# EAGLE design foo1 (EAGLE 6.6.0)
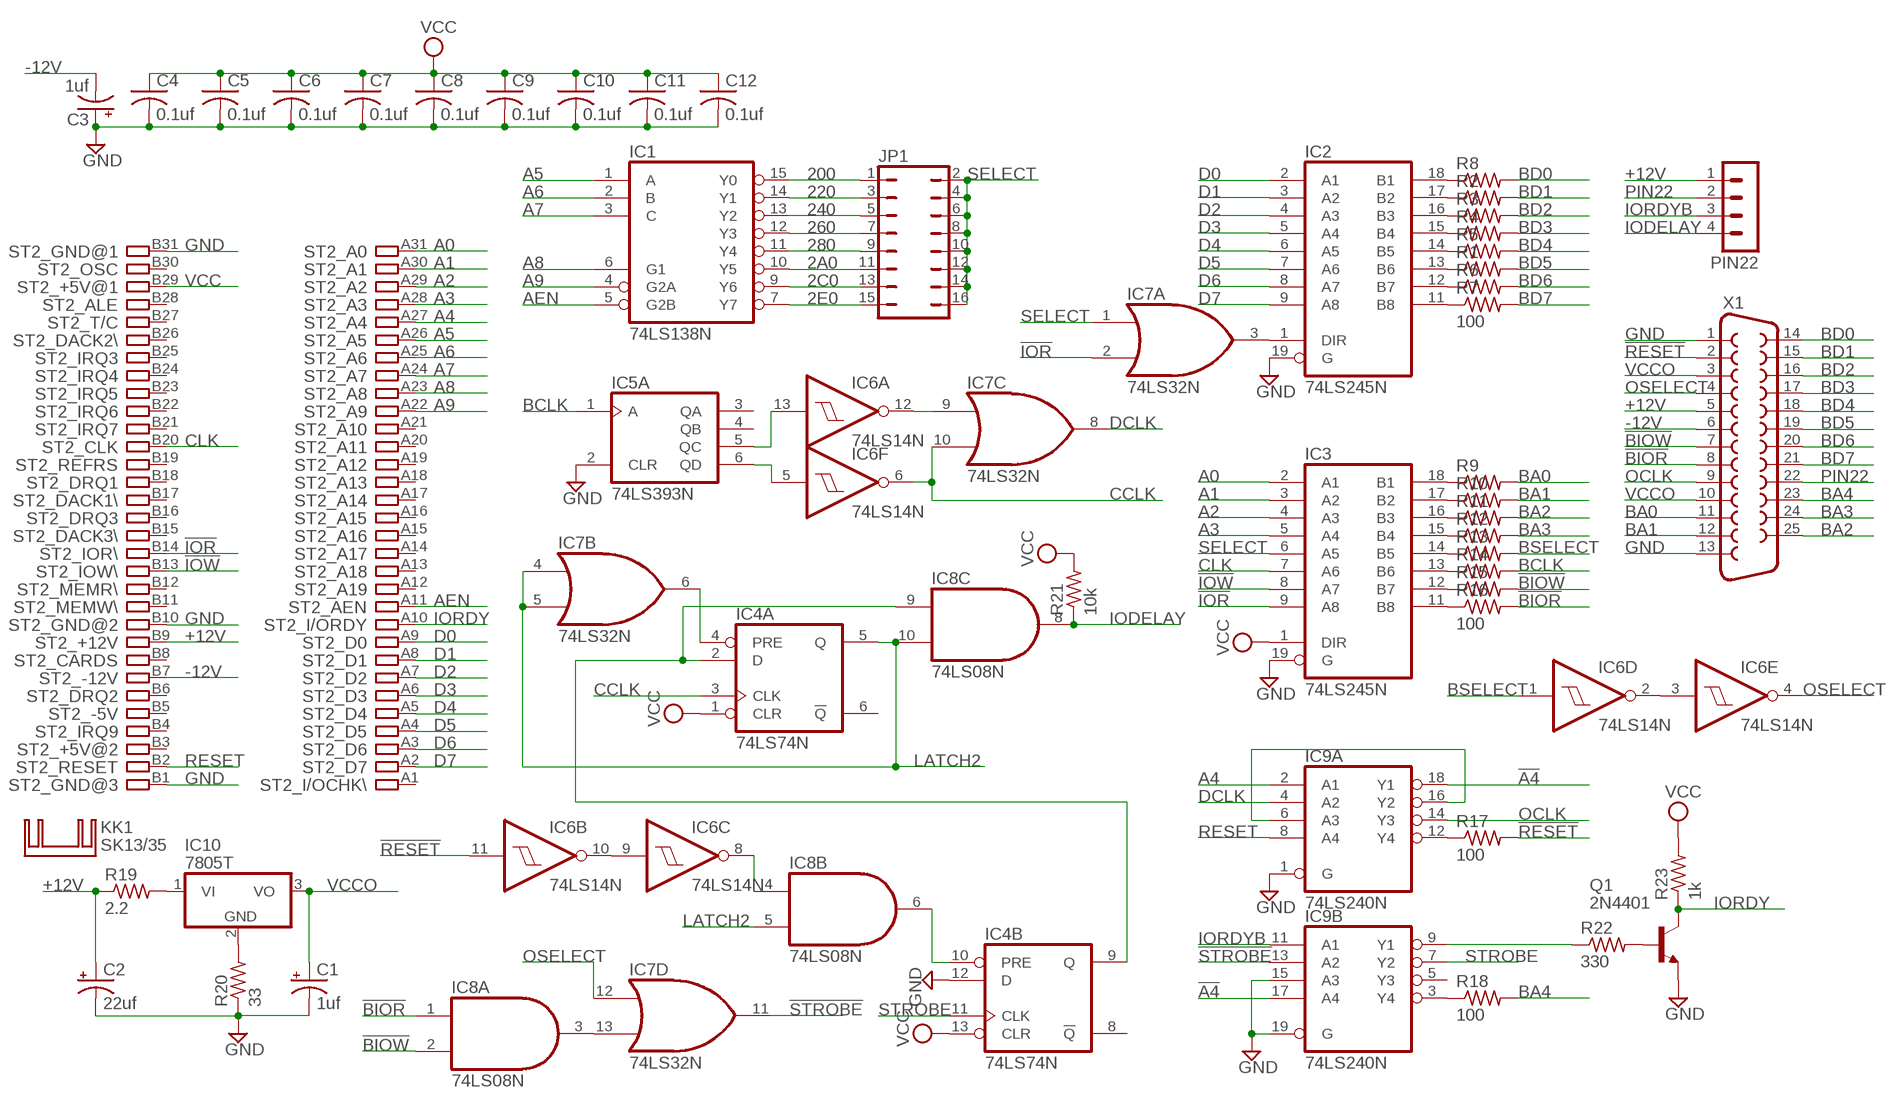
[diagram p0: schematic, sheet 1]

## Parts
C1  1uf  CPOL-USE5-10.5  [E5-10,5]
C2  22uf  CPOL-USE5-10.5  [E5-10,5]
C3  1uf  CPOL-USE5-10.5  [E5-10,5]
C4  0.1uf  C-US050-025X075  [C050-025X075]
C5  0.1uf  C-US050-025X075  [C050-025X075]
C6  0.1uf  C-US050-025X075  [C050-025X075]
C7  0.1uf  C-US050-025X075  [C050-025X075]
C8  0.1uf  C-US050-025X075  [C050-025X075]
C9  0.1uf  C-US050-025X075  [C050-025X075]
C10  0.1uf  C-US050-025X075  [C050-025X075]
C11  0.1uf  C-US050-025X075  [C050-025X075]
C12  0.1uf  C-US050-025X075  [C050-025X075]
IC1  74LS138N  [DIL16]
IC2  74LS245N  [DIL20]
IC3  74LS245N  [DIL20]
IC4  74LS74N  [DIL14]
IC5  74LS393N  [DIL14]
IC6  74LS14N  [DIL14]
IC7  74LS32N  [DIL14]
IC8  74LS08N  [DIL14]
IC9  74LS240N  [DIL20]
IC10  7805T  [TO220H]
JP1  JP8Q  [JP8Q]
KK1  SK13/35  [SK13/35]
PIN22  MA04-1  [MA04-1]
Q1  2N4401  2N4416  [TO92]
R1  R-US_0207/10  [0207/10]
R2  R-US_0207/10  [0207/10]
R3  R-US_0207/10  [0207/10]
R4  R-US_0207/10  [0207/10]
R5  R-US_0207/10  [0207/10]
R6  R-US_0207/10  [0207/10]
R7  100  R-US_0207/10  [0207/10]
R8  R-US_0207/10  [0207/10]
R9  R-US_0207/10  [0207/10]
R10  R-US_0207/10  [0207/10]
R11  R-US_0207/10  [0207/10]
R12  R-US_0207/10  [0207/10]
R13  R-US_0207/10  [0207/10]
R14  R-US_0207/10  [0207/10]
R15  R-US_0207/10  [0207/10]
R16  100  R-US_0207/10  [0207/10]
R17  100  R-US_0207/10  [0207/10]
R18  100  R-US_0207/10  [0207/10]
R19  2.2  R-US_0613/15  [P0613/15]
R20  33  R-US_0207/10  [0207/10]
R21  10k  R-US_0207/10  [0207/10]
R22  330  R-US_0207/10  [0207/10]
R23  1k  R-US_0207/10  [0207/10]
ST2  IBM8BIT  [IBM8BIT]
X1  F25H  [F25H]

## Nets
2A0: IC1.10(Y5) JP1.11
2C0: IC1.9(Y6) JP1.13
2E0: IC1.7(Y7) JP1.15
200: IC1.15(Y0) JP1.1
220: IC1.14(Y1) JP1.3
240: IC1.13(Y2) JP1.5
260: IC1.12(Y3) JP1.7
280: IC1.11(Y4) JP1.9
!A4: IC9.17(B:A4) IC9.18(A:Y1)
!BIOR: IC8.1(A:I0) R16.2 X1.8
!BIOW: IC8.2(A:I1) R15.2 X1.7
!IOR: IC3.9(A8) IC7.2(A:I1) ST2.B14
!IOW: IC3.8(A7) ST2.B13
!RESET: IC6.11(B:I) R17.2 X1.2
!STROBE: IC7.11(D:O) IC9.13(B:A2)
+12V [Power]: C2.+ PIN22.1 R19.1 ST2.B9 X1.5
-12V [Power]: C3.- ST2.B7 X1.6
A0: IC3.2(A1) ST2.A31
A1: IC3.3(A2) ST2.A30
A2: IC3.4(A3) ST2.A29
A3: IC3.5(A4) ST2.A28
A4: IC9.2(A:A1) ST2.A27
A5: IC1.1(A) ST2.A26
A6: IC1.2(B) ST2.A25
A7: IC1.3(C) ST2.A24
A8: IC1.6(G1) ST2.A23
A9: IC1.4(G2A) ST2.A22
AEN: IC1.5(G2B) ST2.A11
BA0: R9.2 X1.11
BA1: R10.2 X1.12
BA2: R11.2 X1.25
BA3: R12.2 X1.24
BA4: R18.2 X1.23
BCLK: IC5.1(A:A) R14.2
BD0: R8.2 X1.14
BD1: R2.2 X1.15
BD2: R3.2 X1.16
BD3: R4.2 X1.17
BD4: R5.2 X1.18
BD5: R1.2 X1.19
BD6: R6.2 X1.20
BD7: R7.2 X1.21
BSELECT: IC6.1(D:I) R13.2
CCLK: IC4.3(A:CLK) IC6.6(F:O) IC7.10(C:I1)
CLK: IC3.7(A6) ST2.B20
D0: IC2.2(A1) ST2.A9
D1: IC2.3(A2) ST2.A8
D2: IC2.4(A3) ST2.A7
D3: IC2.5(A4) ST2.A6
D4: IC2.6(A5) ST2.A5
D5: IC2.7(A6) ST2.A4
D6: IC2.8(A7) ST2.A3
D7: IC2.9(A8) ST2.A2
DCLK: IC7.8(C:O) IC9.4(A:A2)
GND [Power]: C1.- C2.- C3.+ C4.2 C5.2 C6.2 C7.2 C8.2 C9.2 C10.2 C11.2 C12.2 IC2.19(G) IC3.19(G) IC4.12(B:D) IC5.2(A:CLR) IC9.1(A:G) IC9.15(B:A3) IC9.19(B:G) Q1.3(E) R20.1 ST2.B1 ST2.B10 ST2.B31 X1.1 X1.13
IODELAY: IC8.8(C:O) PIN22.4 R21.1
IORDY: Q1.1(C) R23.1 ST2.A10
IORDYB: IC9.11(B:A1) PIN22.3
LATCH2: IC4.5(A:Q) IC7.4(B:I0) IC7.5(B:I1) IC8.5(B:I1) IC8.10(C:I1)
N$1: IC2.1(DIR) IC7.3(A:O)
N$2 [Power]: IC10.2(GND) R20.2
N$3: IC2.13(B6) R1.1
N$4: IC2.17(B2) R2.1
N$5: IC2.16(B3) R3.1
N$6: IC2.15(B4) R4.1
N$7: IC2.14(B5) R5.1
N$8: IC2.12(B7) R6.1
N$9: IC2.11(B8) R7.1
N$10: IC2.18(B1) R8.1
N$11: IC3.18(B1) R9.1
N$12: IC3.17(B2) R10.1
N$13: IC3.16(B3) R11.1
N$14: IC3.15(B4) R12.1
N$15: IC3.14(B5) R13.1
N$16: IC3.13(B6) R14.1
N$17: IC3.12(B7) R15.1
N$18: IC3.11(B8) R16.1
N$19: IC9.12(A:Y4) R17.1
N$20: IC6.9(C:I) IC6.10(B:O)
N$21: IC6.2(D:O) IC6.3(E:I)
N$22: IC5.6(A:QD) IC6.5(F:I)
N$23: IC9.3(B:Y4) R18.1
N$24: IC5.5(A:QC) IC6.13(A:I)
N$25 [Power]: IC10.1(VI) R19.2
N$26: IC6.12(A:O) IC7.9(C:I0)
N$28: IC9.6(A:A3) IC9.16(A:Y2)
N$29: IC7.13(D:I1) IC8.3(A:O)
N$30: IC4.2(A:D) IC4.9(B:Q) IC8.9(C:I0)
N$32: IC9.9(B:Y1) R22.1
N$33: IC4.10(B:PRE) IC8.6(B:O)
N$34: IC6.8(C:O) IC8.4(B:I0)
N$36: IC4.4(A:PRE) IC7.6(B:O)
N$37: Q1.2(B) R22.2
OCLK: IC9.14(A:Y3) X1.9
OSELECT: IC6.4(E:O) IC7.12(D:I0) X1.4
PIN22: PIN22.2 X1.22
RESET: IC9.8(A:A4) ST2.B2
SELECT: IC3.6(A5) IC7.1(A:I0) JP1.2 JP1.4 JP1.6 JP1.8 JP1.10 JP1.12 JP1.14 JP1.16
STROBE: IC4.11(B:CLK) IC9.7(B:Y2)
VCC [Power]: C4.1 C5.1 C6.1 C7.1 C8.1 C9.1 C10.1 C11.1 C12.1 IC3.1(DIR) IC4.1(A:CLR) IC4.13(B:CLR) R21.2 R23.2 ST2.B29
VCCO [Power]: C1.+ IC10.3(VO) X1.3 X1.10
Unconnected: IC4.6(A:!Q) IC4.8(B:!Q) IC5.3(A:QA) IC5.4(A:QB) IC5.8(B:QD) IC5.9(B:QC) IC5.10(B:QB) IC5.11(B:QA) IC5.12(B:CLR) IC5.13(B:A) IC8.11(D:O) IC8.12(D:I0) IC8.13(D:I1) IC9.5(B:Y3) ST2.A1 ST2.A12 ST2.A13 ST2.A14 ST2.A15 ST2.A16 ST2.A17 ST2.A18 ST2.A19 ST2.A20 ST2.A21 ST2.B3 ST2.B4 ST2.B5 ST2.B6 ST2.B8 ST2.B11 ST2.B12 ST2.B15 ST2.B16 ST2.B17 ST2.B18 ST2.B19 ST2.B21 ST2.B22 ST2.B23 ST2.B24 ST2.B25 ST2.B26 ST2.B27 ST2.B28 ST2.B30

## Power pins joined to a net without a drawn wire
GND: IC1.8(GND) IC2.10(GND) IC3.10(GND) IC4.7(P:GND) IC5.7(P:GND) IC6.7(P:GND) IC7.7(P:GND) IC8.7(P:GND) IC9.10(P:GND)
VCC: IC1.16(VCC) IC2.20(VCC) IC3.20(VCC) IC4.14(P:VCC) IC5.14(P:VCC) IC6.14(P:VCC) IC7.14(P:VCC) IC8.14(P:VCC) IC9.20(P:VCC)

## Library data of the parts
C1-C3 = rcl:CPOL-US: POLARIZED CAPACITOR, American symbol
C4-C12 = rcl:C-US: CAPACITOR, American symbol
IC1 = 74xx-us:74*138: 3-line to 8-line DECODER/DEMULTIPLEXER
IC2 IC3 = 74xx-us:74*245: Octal BUS TRANSCEIVER, 3-state
IC4 = 74xx-us:74*74: Dual D type positive edge triggered FLIP FLOP, preset and clear
IC5 = 74xx-us:74*393: Dual 4-bit decade and binary COUNTER
IC6 = 74xx-us:74*14: Hex schmitt trigger INVERTER
IC7 = 74xx-us:74*32: Quad 2-input OR gate
IC8 = 74xx-us:74*08: Quad 2-input AND gate
IC9 = 74xx-us:74*240: Octal BUFFER and LINE DRIVER, 3-state
IC10 = linear:78*: Positive VOLTAGE REGULATOR Source: http://cache.national.com/ds/LM/LM78L05.pdf http://www.fairchildsemi.com/ds/LM/LM7805.pdf
JP1 = jumper:JP8Q: JUMPER
KK1 = heatsink:SK13/35: HEATSINK manufacturer Fischer/distributor Buerklin
PIN22 = con-lstb:MA04-1: PIN HEADER; OC_FARNELL: unknown; OC_NEWARK: unknown
Q1 = transistor-npn:2N4416: NPN Transistor
R1-R23 = rcl:R-US_: RESISTOR, American symbol
ST2 = con-pc:IBM8BIT: 8-bit CARD IBM/PC-AT
X1 = con-subd:F25: SUB-D; OC_FARNELL: unknown; OC_NEWARK: unknown

## Net classes
1 Power: width 0.762 mm, clearance 0.254 mm

## Board
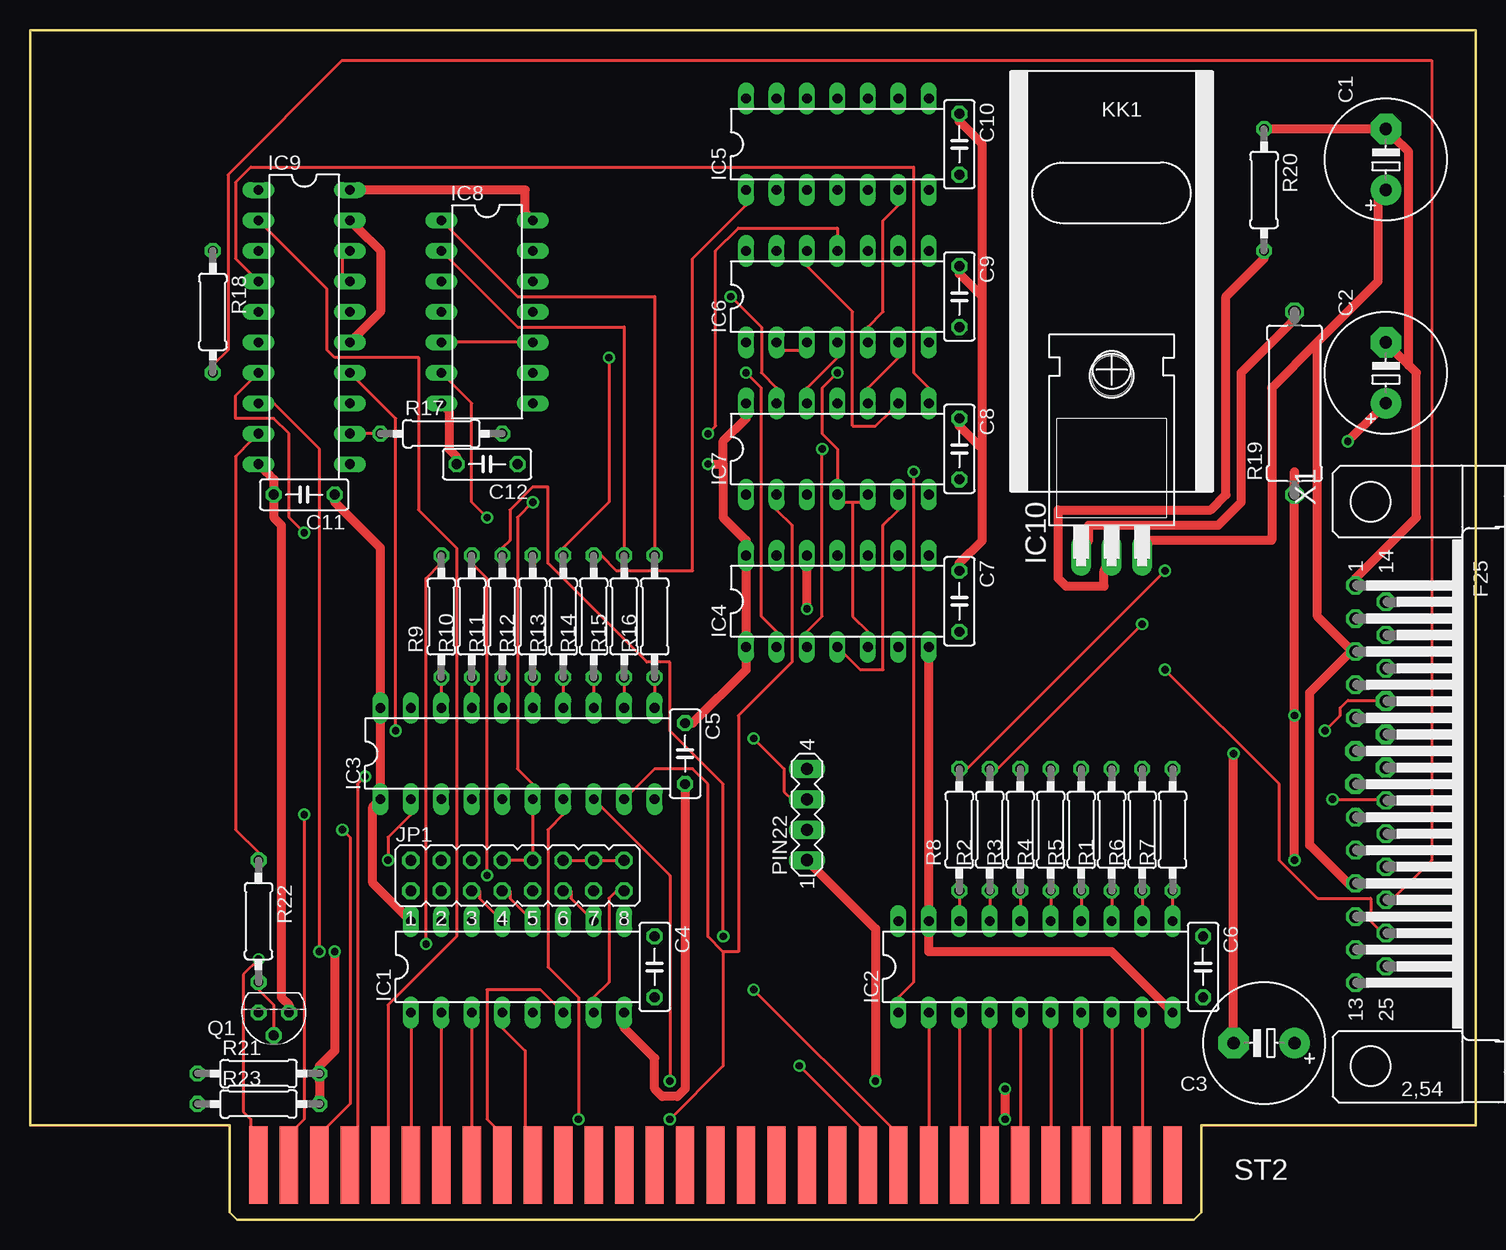
[diagram p1: board, top side]
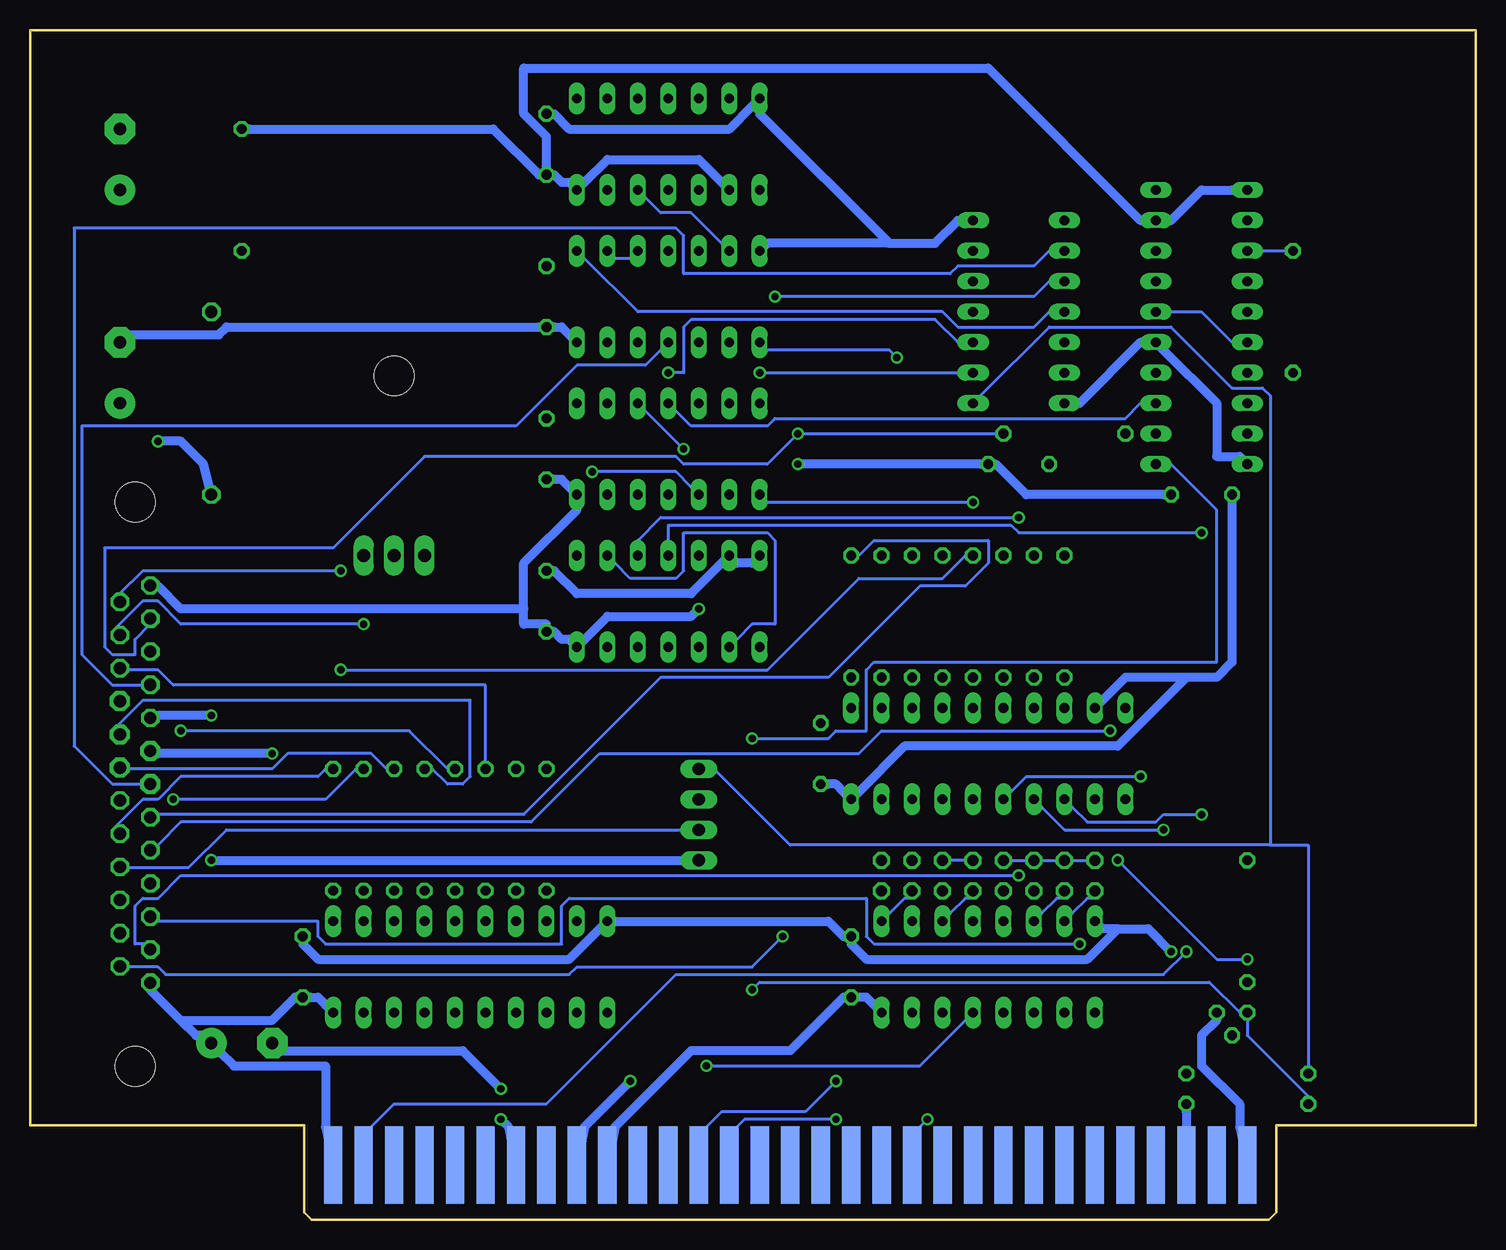
[diagram p2: board, bottom side, seen from below]

Size 120.52 x 99.19 mm. Coordinates in mm from the lower left corner, seen from the top.
Outline: 0,7.87 0,99.19 120.52,99.19 120.52,7.87 97.66,7.87 97.66,0.64 97.03,0 17.27,0 16.64,0.64 16.64,7.87 0.13,7.87
Copper layers (1*16): Top 0.035mm / dielectric 1.5mm / Bottom 0.035mm
Design rules "olimex10mil": minimum track width 10mil, minimum drill 24mil, track to track 10mil, track to pad 10mil, pad to pad 10mil, via to via 10mil, smd to smd 10mil, copper to edge 40mil, drill to drill 10mil, minimum pad ring 10mil, minimum via ring 8mil, stop-mask expansion 0mil, vias tented up to drill 0mil, thermal gap 10mil

### Footprints (pad centres in the part's own frame; a part is rotated, then mirrored left to right if it is on the bottom)
E5-10,5 = drill 1.016 pad 2.54: + -2.54,0 | drill 1.016 pad 2.54 octagon: - 2.54,0
C050-025X075 = drill 0.813 octagon: 1 -2.54,0; 2 2.54,0
DIL16 = drill 0.813 long: 1 -8.89,-3.81; 2 -6.35,-3.81; 3 -3.81,-3.81; 4 -1.27,-3.81; 5 1.27,-3.81; 6 3.81,-3.81; 7 6.35,-3.81; 8 8.89,-3.81; 9 8.89,3.81; 10 6.35,3.81; 11 3.81,3.81; 12 1.27,3.81; 13 -1.27,3.81; 14 -3.81,3.81; 15 -6.35,3.81; 16 -8.89,3.81
DIL20 = drill 0.813 long: 1 -11.43,-3.81; 2 -8.89,-3.81; 3 -6.35,-3.81; 4 -3.81,-3.81; 5 -1.27,-3.81; 6 1.27,-3.81; 7 3.81,-3.81; 8 6.35,-3.81; 9 8.89,-3.81; 10 11.43,-3.81; 11 11.43,3.81; 12 8.89,3.81; 13 6.35,3.81; 14 3.81,3.81; 15 1.27,3.81; 16 -1.27,3.81; 17 -3.81,3.81; 18 -6.35,3.81; 19 -8.89,3.81; 20 -11.43,3.81
DIL14 = drill 0.813 long: 1 -7.62,-3.81; 2 -5.08,-3.81; 3 -2.54,-3.81; 4 0,-3.81; 5 2.54,-3.81; 6 5.08,-3.81; 7 7.62,-3.81; 8 7.62,3.81; 9 5.08,3.81; 10 2.54,3.81; 11 0,3.81; 12 -2.54,3.81; 13 -5.08,3.81; 14 -7.62,3.81
TO220H = drill 1.118 long: 1 -2.54,-10.16; 2 0,-10.16; 3 2.54,-10.16 | hole 3.302: 0,4.826
JP8Q = drill 0.914 octagon: 1 -8.89,-1.27; 2 -8.89,1.27; 3 -6.35,-1.27; 4 -6.35,1.27; 5 -3.81,-1.27; 6 -3.81,1.27; 7 -1.27,-1.27; 8 -1.27,1.27; 9 1.27,-1.27; 10 1.27,1.27; 11 3.81,-1.27; 12 3.81,1.27; 13 6.35,-1.27; 14 6.35,1.27; 15 8.89,-1.27; 16 8.89,1.27
MA04-1 = drill 1.016 long: 1 -3.81,0; 2 -1.27,0; 3 1.27,0; 4 3.81,0
TO92 = drill 0.813 octagon: 1 1.27,0; 2 0,1.905; 3 -1.27,0
0207/10 = drill 0.813 octagon: 1 -5.08,0; 2 5.08,0
P0613/15 = drill 1.016 octagon: 1 -7.62,0; 2 7.62,0
IBM8BIT = smd 1.524 x 6.477: A1 -25.4,5.08; A2 -27.94,5.08; A3 -30.48,5.08; A4 -33.02,5.08; A5 -35.56,5.08; A6 -38.1,5.08; A7 -40.64,5.08; A8 -43.18,5.08; A9 -45.72,5.08; A10 -48.26,5.08; A11 -50.8,5.08; A12 -53.34,5.08; A13 -55.88,5.08; A14 -58.42,5.08; A15 -60.96,5.08; A16 -63.5,5.08; A17 -66.04,5.08; A18 -68.58,5.08; A19 -71.12,5.08; A20 -73.66,5.08; A21 -76.2,5.08; A22 -78.74,5.08; A23 -81.28,5.08; A24 -83.82,5.08; A25 -86.36,5.08; A26 -88.9,5.08; A27 -91.44,5.08; A28 -93.98,5.08; A29 -96.52,5.08; A30 -99.06,5.08; A31 -101.6,5.08 | smd 1.524 x 6.477 bottom: B1 -25.4,5.08; B2 -27.94,5.08; B3 -30.48,5.08; B4 -33.02,5.08; B5 -35.56,5.08; B6 -38.1,5.08; B7 -40.64,5.08; B8 -43.18,5.08; B9 -45.72,5.08; B10 -48.26,5.08; B11 -50.8,5.08; B12 -53.34,5.08; B13 -55.88,5.08; B14 -58.42,5.08; B15 -60.96,5.08; B16 -63.5,5.08; B17 -66.04,5.08; B18 -68.58,5.08; B19 -71.12,5.08; B20 -73.66,5.08; B21 -76.2,5.08; B22 -78.74,5.08; B23 -81.28,5.08; B24 -83.82,5.08; B25 -86.36,5.08; B26 -88.9,5.08; B27 -91.44,5.08; B28 -93.98,5.08; B29 -96.52,5.08; B30 -99.06,5.08; B31 -101.6,5.08
F25H = drill 1.016 octagon: 1 -16.561,-1.27; 2 -13.792,-1.27; 3 -11.049,-1.27; 4 -8.28,-1.27; 5 -5.512,-1.27; 8 2.769,-1.27; 9 5.512,-1.27; 10 8.28,-1.27; 11 11.049,-1.27; 12 13.792,-1.27; 13 16.561,-1.27; 14 -15.189,1.27; 15 -12.421,1.27; 16 -9.652,1.27; 20 1.372,1.27; 21 4.14,1.27; 22 6.909,1.27; 23 9.652,1.27; 24 12.421,1.27; 25 15.189,1.27 | drill 1.016 pad 1.67 octagon: 6 -2.769,-1.27; 7 0,-1.27; 17 -6.909,1.27; 18 -4.14,1.27; 19 -1.372,1.27 | hole 3.302: -23.52,0; 23.52,0

### Placement (x,y rotation side)
C1  113.03,88.39 90 top
C2  113.03,70.61 90 top
C3  102.87,14.73 180 top
C4  52.07,21.08 270 top
C5  54.61,38.86 270 top
C6  97.79,21.08 270 top
C7  77.47,51.56 270 top
C8  77.47,64.26 270 top
C9  77.47,76.96 270 top
C10  77.47,89.66 270 top
C11  22.86,60.45 180 top
C12  38.1,62.99 180 top
IC1  40.64,21.08 0 top
IC2  83.82,21.08 0 top
IC3  40.64,38.86 0 top
IC4  67.31,51.56 0 top
IC5  67.31,89.66 0 top
IC6  67.31,76.96 0 top
IC7  67.31,64.26 0 top
IC8  38.1,75.69 270 top
IC9  22.86,74.42 270 top
IC10  90.17,65.53 0 top
JP1  40.64,28.7 0 top
KK1  90.17,82.04 90 top
PIN22  64.77,33.78 90 top
Q1  20.32,17.27 180 top
R1  90.17,32.51 90 top
R2  80.01,32.51 90 top
R3  82.55,32.51 90 top
R4  85.09,32.51 90 top
R5  87.63,32.51 90 top
R6  92.71,32.51 90 top
R7  95.25,32.51 90 top
R8  77.47,32.51 90 top
R9  34.29,50.29 90 top
R10  36.83,50.29 90 top
R11  39.37,50.29 90 top
R12  41.91,50.29 90 top
R13  44.45,50.29 90 top
R14  46.99,50.29 90 top
R15  49.53,50.29 90 top
R16  52.07,50.29 90 top
R17  34.29,65.53 0 top
R18  15.24,75.69 270 top
R19  105.41,68.07 90 top
R20  102.87,85.85 270 top
R21  19.05,12.19 0 top
R22  19.05,24.89 270 top
R23  19.05,9.65 0 top
ST2  120.65,-0.51 0 top
X1  111.76,36.32 270 top

### Tracks (layer width: path | path; a pad name or v marks a point on that pad's centre or on a via)
2A0
  Top 0.254: IC1.10 46.36,25.53 45.09,26.8 45.09,27.43 JP1.11
2C0
  Bottom 0.254: IC1.9 48.9,25.53 47.62,26.8 46.99,26.8 JP1.13
2E0
  Top 0.254: IC1.7 46.99,18.54 48.26,19.81 48.26,26.8 48.9,27.43 JP1.15
200
  Bottom 0.254: IC1.15 33.66,25.53 32.39,26.8 31.75,26.8 JP1.1
220
  Bottom 0.254: IC1.14 36.2,25.53 34.93,26.8 34.29,26.8 JP1.3
240
  Top 0.254: IC1.13 38.73,25.53 37.47,26.8 37.47,27.43 JP1.5
260
  Top 0.254: IC1.12 41.28,25.53 40.01,26.8 40.01,27.43 JP1.7
280
  Bottom 0.254: IC1.11 43.82,25.53 42.55,26.8 41.91,26.8 JP1.9
!A4
  Top 0.254: IC9.17 26.04,78.87 26.04,80.14 IC9.18
!BIOR
  Top 0.254: IC8.1 34.93,82.68 40.64,76.96 52.07,76.96 52.07,56.01 R16.2
  Bottom 0.254: X1.8 109.86,33.78 79.38,33.78 67.95,45.21 53.98,45.21 46.36,52.83 42.55,52.83 40.64,54.74 40.64,56.64 50.17,56.64 51.44,55.37 R16.2
!BIOW
  Top 0.254: IC8.2 34.93,80.14 40.64,74.42 49.53,74.42 49.53,56.01 R15.2
  Bottom 0.254: X1.7 111.12,36.32 113.67,36.32 116.84,39.5 116.84,82.68 66.68,82.68 66.04,82.04 66.04,78.87 43.82,78.87 43.18,79.5 36.83,79.5 35.56,80.77 IC8.2
!IOR  (via drill 0.61)
  Top 0.254: 57.79,22.35 56.52,23.62 56.52,36.32 55.25,37.59 52.07,37.59 50.17,35.69 IC3.9 | 57.79,22.35 59.06,22.35 59.06,42.04 63.5,46.48 63.5,57.91 62.23,59.18 IC7.2 | v53.34,8.38 57.79,12.83 57.79,22.35
  Bottom 0.254: v53.34,8.38 60.96,8.38 61.6,7.75 ST2.B14
!IOW  (via drill 0.61)
  Top 0.254: v53.34,11.56 53.34,28.7 47.62,34.42 IC3.8
  Bottom 0.254: v53.34,11.56 55.88,9.02 62.87,9.02 64.14,7.75 ST2.B13
!RESET  (via drill 0.61)
  Top 0.254: v56.52,65.53 57.15,66.17 57.15,80.77 59.06,82.68 67.31,82.68 67.31,82.04 IC6.11
  Bottom 0.254: R17.2 40.01,65.53 v56.52,65.53 59.06,62.99 66.04,62.99 66.68,63.63 87.63,63.63 95.25,56.01 114.3,56.01 114.3,47.75 113.67,47.12 111.76,47.12 111.76,48.39 110.49,49.66 X1.2
!STROBE
  Bottom 0.254: IC9.13 27.94,68.07 29.21,66.8 58.42,66.8 59.06,66.17 65.41,66.17 66.68,67.44 IC7.11
+12V  (via drill 0.61)
  Top 0.762: v70.49,11.56 70.49,24.26 65.41,29.34 PIN22.1 | v109.86,64.9 112.4,67.44 C2.+ | R19.1 105.41,62.36 v105.41,42.04 v105.41,29.97
  Bottom 0.762: v70.49,11.56 74.3,7.75 ST2.B9 | v109.86,64.9 107.95,64.9 106.05,62.99 R19.1 | v105.41,42.04 109.86,42.04 X1.5 | v105.41,29.97 66.04,29.97 PIN22.1
-12V  (via drill 0.61)
  Top 0.762: v100.33,38.86 100.33,15.37 C3.- | v81.28,10.92 v81.28,8.38
  Bottom 0.762: v100.33,38.86 109.86,38.86 X1.6 | v81.28,8.38 80.65,7.75 ST2.B7 | v81.28,10.92 84.46,14.1 99.7,14.1 C3.-
A0  (via drill 0.61)
  Top 0.254: v29.84,29.97 29.84,31.88 31.75,33.78 IC3.2 | v19.05,21.72 17.78,20.45 17.78,9.02 18.42,8.38 18.42,7.75 ST2.A31
  Bottom 0.254: v29.84,29.97 21.59,21.72 v19.05,21.72
A1  (via drill 0.61)
  Top 0.254: v22.86,33.78 22.86,8.38 22.23,7.75 ST2.A30
  Bottom 0.254: v22.86,33.78 26.04,33.78 26.67,33.15 32.39,33.15 33.66,34.42 IC3.3
A2  (via drill 0.61)
  Top 0.254: v26.04,32.51 26.67,31.88 26.67,9.65 24.77,7.75 ST2.A29
  Bottom 0.254: v26.04,32.51 34.29,32.51 36.2,34.42 IC3.4
A3  (via drill 0.61)
  Top 0.254: v27.94,36.96 27.31,36.32 27.31,7.75 ST2.A28
  Bottom 0.254: v27.94,36.96 37.47,36.96 38.73,35.69 IC3.5
A4
  Top 0.254: IC9.2 19.69,82.68 24.77,77.6 24.77,72.52 25.4,71.88 32.39,71.88 32.39,59.18 35.56,56.01 35.56,23.62 29.84,17.91 29.84,7.75 ST2.A27
A5
  Top 0.254: IC1.1 31.75,16 31.75,7.75 ST2.A26
A6
  Top 0.254: IC1.2 34.29,16 34.29,7.75 ST2.A25
A7
  Top 0.254: IC1.3 36.83,16 36.83,7.75 ST2.A24
A8
  Top 0.254: IC1.6 43.82,17.91 42.55,19.18 38.1,19.18 38.1,8.38 38.73,7.75 ST2.A23
A9
  Top 0.254: IC1.4 39.37,16 41.28,14.1 41.28,7.75 ST2.A22
AEN  (via drill 0.61)
  Top 0.254: v64.14,12.83 69.22,7.75 ST2.A11
  Bottom 0.254: v64.14,12.83 46.36,12.83 42.55,16.64 IC1.5
BA0  (via drill 0.61)
  Top 0.254: v33.02,22.99 33.02,53.47 34.29,54.74 R9.2
  Bottom 0.254: v33.02,22.99 50.17,22.99 50.8,23.62 50.8,26.8 75.56,26.8 76.2,26.16 76.2,22.99 95.89,22.99 96.52,23.62 96.52,24.89 109.86,24.89 X1.11
BA1  (via drill 0.61)
  Top 0.254: v38.1,28.7 38.1,53.47 36.83,54.74 R10.2
  Bottom 0.254: v38.1,28.7 107.95,28.7 109.86,26.8 111.12,26.8 111.76,26.16 111.76,22.99 110.49,22.99 X1.12
BA2  (via drill 0.61)
  Top 0.254: v57.79,23.62 57.79,36.32 53.34,40.77 53.34,46.48 51.44,46.48 43.18,54.74 43.18,61.09 41.91,61.09 40.01,59.18 40.01,56.64 39.37,56.01 R11.2
  Bottom 0.254: v57.79,23.62 60.33,21.08 74.93,21.08 75.56,20.45 109.22,20.45 109.86,21.08 112.4,21.08 X1.25
BA3  (via drill 0.61)
  Top 0.254: v94.62,45.85 104.14,36.32 104.14,29.97 107.31,26.8 111.76,26.8 111.76,24.89 112.4,24.26 X1.24
  Bottom 0.254: v94.62,45.85 59.06,45.85 51.44,53.47 44.45,53.47 42.55,55.37 R12.2
BA4
  Top 0.254: R18.2 15.24,71.25 16.51,72.52 16.51,87.12 26.04,96.65 116.84,96.65 116.84,29.97 113.67,26.8 X1.23
BCLK
  Top 0.254: R14.2 47.62,55.37 48.9,54.1 55.25,54.1 55.25,80.14 59.69,84.58 IC5.1
BD0  (via drill 0.61)
  Top 0.254: v94.62,54.1 78.11,37.59 R8.2
  Bottom 0.254: v94.62,54.1 111.12,54.1 113.03,52.2 X1.14
BD1  (via drill 0.61)
  Top 0.254: v92.71,49.66 80.65,37.59 R2.2
  Bottom 0.254: v92.71,49.66 107.95,49.66 109.86,51.56 111.12,51.56 113.67,49.02 X1.15
BD2
  Bottom 0.254: R3.2 82.55,38.23 82.55,44.58 108.59,44.58 109.86,45.85 112.4,45.85 X1.16
BD3  (via drill 0.61)
  Top 0.254: v107.95,40.77 109.22,42.04 109.22,42.67 109.86,43.31 112.4,43.31 X1.17
  Bottom 0.254: v107.95,40.77 88.9,40.77 85.73,37.59 R4.2
BD4
  Bottom 0.254: R5.2 87,37.59 85.73,36.32 84.46,36.32 83.82,36.96 83.82,43.31 111.12,43.31 113.67,40.77 X1.18
BD5
  Bottom 0.254: R1.2 90.81,37.59 92.08,38.86 99.06,38.86 100.33,37.59 112.4,37.59 X1.19
BD6  (via drill 0.61)
  Top 0.254: v108.59,35.05 112.4,35.05 X1.20
  Bottom 0.254: v108.59,35.05 95.89,35.05 93.34,37.59 R6.2
BD7
  Bottom 0.254: R7.2 95.89,37.59 96.52,36.96 107.95,36.96 109.86,35.05 111.12,35.05 113.67,32.51 X1.21
BSELECT  (via drill 0.61)
  Top 0.254: v48.26,71.88 48.26,59.82 44.45,56.01 R13.2
  Bottom 0.254: v48.26,71.88 48.9,72.52 59.06,72.52 IC6.1
CCLK  (via drill 0.61)
  Top 0.254: v66.04,64.26 66.04,50.29 64.77,49.02 IC4.3 | IC6.6 72.39,71.88 69.85,69.34 IC7.10
  Bottom 0.254: v66.04,64.26 69.22,67.44 IC7.10
CLK  (via drill 0.61)
  Top 0.254: v45.72,8.38 45.72,18.54 43.18,21.08 43.18,32.51 44.45,33.78 IC3.7
  Bottom 0.254: v45.72,8.38 46.36,7.75 ST2.B20
D0
  Top 0.254: IC2.2 74.93,16 74.93,7.75 ST2.A9
D1
  Top 0.254: IC2.3 77.47,16 77.47,7.75 ST2.A8
D2
  Top 0.254: IC2.4 80.01,16 80.01,7.75 ST2.A7
D3
  Top 0.254: IC2.5 82.55,16 82.55,7.75 ST2.A6
D4
  Top 0.254: IC2.6 85.09,16 85.09,7.75 ST2.A5
D5
  Top 0.254: IC2.7 87.63,16 87.63,7.75 ST2.A4
D6
  Top 0.254: IC2.8 90.17,16 90.17,7.75 ST2.A3
D7
  Top 0.254: IC2.9 92.71,16 92.71,7.75 ST2.A2
DCLK
  Top 0.254: IC9.4 18.42,78.87 17.15,80.14 17.15,86.49 18.42,87.76 73.66,87.76 73.66,70.61 74.93,69.34 IC7.8
GND  (via drill 0.61)
  Top 0.762: C12.2 35.56,63.63 34.93,64.26 34.93,67.44 IC8.7 | IC9.19 27.31,82.68 29.21,80.77 29.21,75.69 27.31,73.79 IC9.15 | IC9.10 19.69,62.36 20.32,61.72 20.32,61.09 C11.2 20.32,59.82 20.32,58.55 20.96,57.91 20.96,18.54 21.59,17.91 Q1.3 | IC1.8 49.53,16 52.07,13.46 52.07,10.92 52.71,10.29 53.98,10.29 54.61,10.92 54.61,35.69 C5.2 | 114.94,71.25 113.67,72.52 C2.- | 114.94,71.25 115.57,70.61 115.57,58.55 110.49,53.47 X1.1 | 114.94,71.25 114.94,89.03 113.67,90.3 C1.- 112.4,90.93 103.51,90.93 R20.1 | IC4.7 74.93,46.48 74.93,26.16 IC2.19 74.93,23.62 74.93,22.35 90.17,22.35 94.62,17.91 IC2.10 | v64.77,50.93 64.77,54.1 IC4.12
  Bottom 0.762: IC1.8 50.17,17.91 50.8,18.54 51.44,18.54 C4.2 52.71,18.54 57.15,14.1 65.41,14.1 71.75,7.75 ST2.B10 | IC9.1 20.32,85.85 22.86,85.85 25.4,83.31 IC9.19 27.94,83.31 40.64,96.01 79.38,96.01 79.38,92.2 77.47,90.3 77.47,87.76 C10.2 | IC8.7 33.02,68.07 27.94,73.15 IC9.15 26.04,72.52 21.59,68.07 21.59,63.63 19.69,63.63 IC9.10 | Q1.3 21.59,16.64 22.86,15.37 22.86,12.83 19.69,9.65 19.69,7.75 ST2.B31 | C5.2 53.98,36.32 53.34,36.32 52.71,35.69 IC3.10 51.44,35.69 47.62,39.5 29.84,39.5 24.13,45.21 | 24.13,45.21 21.59,45.21 20.32,46.48 20.32,59.82 C11.2 | 24.13,45.21 29.21,45.21 31.12,43.31 IC3.19 | IC5.2 62.87,86.49 64.77,88.39 72.39,88.39 74.3,86.49 IC5.7 75.56,86.49 76.2,86.49 76.84,87.12 C10.2 | IC6.7 75.56,73.79 76.2,74.42 76.84,74.42 C9.2 78.11,74.42 104.14,74.42 104.78,73.79 112.4,73.79 C2.- | IC2.10 95.89,17.91 96.52,18.54 97.16,18.54 C6.2 98.43,18.54 100.33,16.64 107.95,16.64 | 107.95,16.64 106.68,15.37 106.05,15.37 C3.+ 104.78,14.1 103.51,12.83 95.89,12.83 95.89,7.75 ST2.B1 | 107.95,16.64 110.49,19.18 X1.13 | C8.2 76.84,61.72 76.2,61.72 75.56,61.09 IC7.7 74.93,59.18 79.38,54.74 79.38,50.93 | v64.77,50.93 65.41,50.29 72.39,50.29 74.3,48.39 IC4.7 75.56,48.39 76.2,48.39 76.84,49.02 C7.2 77.47,49.66 79.38,49.66 79.38,50.93 | 79.38,50.93 107.95,50.93 109.86,52.83 X1.1 | C10.2 78.11,87.12 81.92,90.93 102.24,90.93 R20.1
IODELAY
  Bottom 0.254: 17.15,31.24 57.15,31.24 63.5,37.59 PIN22.4 | 17.15,31.24 13.97,31.24 13.97,12.83 R21.1 | 17.15,31.24 17.15,68.71 17.78,69.34 20.32,69.34 25.4,74.42 35.56,74.42 41.28,68.71 IC8.8
IORDY  (via drill 0.61)
  Top 0.254: v60.33,19.18 71.75,7.75 ST2.A10
  Bottom 0.254: R23.1 13.97,10.29 19.05,15.37 19.05,16.64 Q1.1 19.69,17.27 22.23,19.81 59.69,19.81 v60.33,19.18
IORDYB  (via drill 0.61)
  Top 0.254: v60.33,40.13 62.87,37.59 62.87,35.69 63.5,35.05 PIN22.3
  Bottom 0.254: v60.33,40.13 53.98,40.13 53.34,40.77 50.8,40.77 50.8,45.85 50.17,46.48 21.59,46.48 21.59,59.18 25.4,62.99 IC9.11
LATCH2  (via drill 0.61)
  Top 0.254: IC8.5 35.56,73.15 40.64,73.15 IC8.10 | 68.58,59.82 69.22,59.82 IC7.5 | 68.58,59.82 67.95,59.82 IC7.4 67.31,61.72 67.31,64.26 66.04,65.53 66.04,69.34 v67.31,70.61 | 68.58,59.82 68.58,50.29 69.85,49.02 IC4.5
  Bottom 0.254: v67.31,70.61 66.04,70.61 66.04,74.42 65.41,75.06 45.09,75.06 43.18,73.15 IC8.10
N$1  (via drill 0.61)
  Top 0.254: v73.66,62.36 73.66,19.81 72.39,18.54 IC2.1
  Bottom 0.254: v73.66,62.36 66.68,62.36 65.41,61.09 IC7.3
N$2
  Top 0.762: R20.2 102.87,80.14 99.7,76.96 99.7,60.45 98.43,59.18 85.73,59.18 85.73,53.47 86.36,52.83 89.54,52.83 89.54,54.1 IC10.2
N$3
  Top 0.254: IC2.13 90.17,26.16 90.17,26.8 R1.1
N$4
  Top 0.254: IC2.17 80.01,26.16 80.01,26.8 R2.1
N$5
  Top 0.254: IC2.16 82.55,26.16 82.55,26.8 R3.1
N$6
  Top 0.254: IC2.15 85.09,26.16 85.09,26.8 R4.1
N$7
  Top 0.254: IC2.14 87.63,26.16 87.63,26.8 R5.1
N$8
  Top 0.254: IC2.12 92.71,26.16 92.71,26.8 R6.1
N$9
  Top 0.254: IC2.11 95.25,26.16 95.25,26.8 R7.1
N$10
  Top 0.254: IC2.18 77.47,26.16 77.47,26.8 R8.1
N$11
  Top 0.254: IC3.18 34.29,43.94 34.29,44.58 R9.1
N$12
  Top 0.254: IC3.17 36.83,43.94 36.83,44.58 R10.1
N$13
  Top 0.254: IC3.16 39.37,43.94 39.37,44.58 R11.1
N$14
  Top 0.254: IC3.15 41.91,43.94 41.91,44.58 R12.1
N$15
  Top 0.254: IC3.14 44.45,43.94 44.45,44.58 R13.1
N$16
  Top 0.254: IC3.13 46.99,43.94 46.99,44.58 R14.1
N$17
  Top 0.254: IC3.12 49.53,43.94 49.53,44.58 R15.1
N$18
  Top 0.254: IC3.11 52.07,43.94 52.07,44.58 R16.1
N$19
  Top 0.254: IC9.12 27.94,65.53 28.58,65.53 R17.1
N$20
  Bottom 0.254: IC6.10 70.49,80.14 71.75,80.14 IC6.9
N$21
  Top 0.254: IC6.2 62.87,72.52 64.14,72.52 IC6.3
N$22
  Top 0.254: IC6.5 69.85,74.42 71.12,75.69 71.12,83.31 72.39,84.58 IC5.6
N$23
  Bottom 0.254: R18.1 15.88,80.77 17.78,80.77 IC9.3
N$24
  Bottom 0.254: IC6.13 62.87,81.41 65.41,83.95 67.95,83.95 69.22,85.22 IC5.5
N$25
  Top 0.762: R19.2 105.41,75.06 100.97,70.61 100.97,59.82 99.06,57.91 88.27,57.91 88.27,56.64 IC10.1
N$26
  Top 0.254: IC7.9 71.75,67.44 70.49,66.17 68.58,66.17 68.58,75.69 64.77,79.5 IC6.12
N$28
  Bottom 0.254: IC9.6 20.32,73.15 22.86,75.69 25.4,75.69 IC9.16
N$29  (via drill 0.61)
  Top 0.254: v58.42,76.96 60.96,74.42 60.96,70.61 62.23,69.34 IC7.13
  Bottom 0.254: v58.42,76.96 36.83,76.96 35.56,78.23 IC8.3
N$30  (via drill 0.61)
  Top 0.254: v59.69,70.61 60.96,69.34 60.96,50.29 62.23,49.02 IC4.2
  Bottom 0.254: v59.69,70.61 43.18,70.61 IC8.9 | IC4.9 71.75,54.74 70.49,53.47 66.68,53.47 66.04,54.1 66.04,57.28 59.06,57.28 58.42,56.64 58.42,49.66 60.33,49.66 61.6,48.39 IC4.2
N$32
  Top 0.254: R22.1 19.05,30.61 17.15,32.51 17.15,63.63 18.42,64.9 IC9.9
N$33  (via drill 0.61)
  Top 0.254: v38.1,58.55 36.83,59.82 36.83,68.07 34.93,69.98 IC8.6
  Bottom 0.254: v38.1,58.55 67.95,58.55 69.85,56.64 IC4.10
N$34
  Bottom 0.254: IC8.4 35.56,75.69 36.83,74.42 43.18,74.42 44.45,75.69 69.85,75.69 74.3,80.14 IC6.8
N$36
  Top 0.254: IC4.4 67.95,47.12 69.22,45.85 71.12,45.85 71.12,57.91 72.39,59.18 IC7.6
N$37
  Top 0.254: R22.2 19.05,19.18 20.32,17.91 20.32,16 Q1.2
OCLK  (via drill 0.61)
  Top 0.254: v30.48,40.77 30.48,66.8 27.31,69.98 IC9.14
  Bottom 0.254: v30.48,40.77 49.53,40.77 51.44,38.86 73.03,38.86 78.74,33.15 107.95,33.15 109.86,31.24 X1.9
OSELECT
  Top 0.254: IC7.12 64.77,69.34 67.31,71.88 IC6.4
  Bottom 0.254: X1.4 111.12,44.58 113.67,44.58 116.21,47.12 116.21,66.17 80.01,66.17 74.93,71.25 69.22,71.25 67.95,72.52 IC6.4
PIN22
  Bottom 0.254: X1.22 112.4,29.34 107.31,29.34 104.14,32.51 66.04,32.51 PIN22.2
RESET  (via drill 0.61)
  Top 0.254: v24.13,22.35 24.13,64.26 20.32,68.07 IC9.8
  Bottom 0.254: v24.13,22.35 26.04,20.45 66.68,20.45 77.47,9.65 90.17,9.65 92.08,7.75 ST2.B2
SELECT  (via drill 0.61)
  Top 0.254: v41.91,59.82 40.64,58.55 40.64,37.59 41.91,36.32 IC3.6 41.91,33.78 41.91,30.61 JP1.10 41.28,29.97 40.01,29.97 JP1.8 | JP1.12 45.09,29.97 46.36,29.97 JP1.14 47.62,29.97 48.9,29.97 JP1.16
  Bottom 0.254: JP1.2 32.39,29.97 33.66,29.97 JP1.4 34.93,29.97 36.2,29.97 JP1.6 37.47,29.97 38.73,29.97 JP1.8 | v41.91,59.82 59.06,59.82 IC7.1 | JP1.12 43.82,29.97 42.55,29.97 JP1.10
STROBE  (via drill 0.61)
  Top 0.254: v22.86,57.28 21.59,58.55 21.59,65.53 20.32,66.8 17.15,66.8 17.15,68.71 18.42,69.98 IC9.7
  Bottom 0.254: v22.86,57.28 38.1,57.28 38.73,57.91 67.31,57.91 67.31,56.64 IC4.11
VCC  (via drill 0.61)
  Top 0.762: IC9.20 27.94,85.85 41.28,85.85 41.28,83.95 IC8.14 | C5.1 55.25,41.4 59.69,45.85 59.69,46.48 IC4.1 59.69,49.02 59.69,54.1 IC4.14 59.69,56.64 57.79,58.55 57.79,62.99 | 57.79,62.99 57.79,64.9 59.69,66.8 IC7.14 | 79.38,64.26 79.38,56.64 77.47,54.74 C7.1 | 79.38,64.26 77.47,66.17 C8.1 | 79.38,76.96 77.47,78.87 C9.1 | 79.38,64.26 79.38,76.96 | 79.38,76.96 79.38,89.66 77.47,91.57 C10.1 | R23.2 24.13,10.29 24.13,11.56 R21.2 24.13,12.83 25.4,14.1 v25.4,22.35 | IC1.16 31.12,25.53 28.58,28.07 28.58,34.42 IC3.1 29.21,36.32 29.21,41.4 IC3.20 29.21,43.94 29.21,56.01 25.4,59.82 C11.1 | v56.52,62.99 57.79,62.99
  Bottom 0.762: 48.9,81.41 59.06,81.41 IC6.14 | 48.9,81.41 45.09,81.41 43.18,83.31 IC8.14 | 48.9,81.41 59.69,92.2 IC5.14 60.33,92.84 62.23,90.93 75.56,90.93 76.84,92.2 C10.1 | IC4.14 60.33,54.74 61.6,54.74 IC4.13 62.87,54.74 65.41,52.2 74.93,52.2 76.84,54.1 C7.1 | C6.1 97.79,22.99 96.52,21.72 75.56,21.72 73.03,24.26 IC2.20 71.75,24.89 53.98,24.89 52.71,23.62 C4.1 52.07,22.99 50.8,21.72 32.39,21.72 29.84,24.26 | R23.2 24.13,9.02 24.13,7.75 ST2.B29 | C11.1 26.04,60.45 37.47,60.45 40.01,62.99 C12.1 41.28,62.99 v56.52,62.99 | v25.4,22.35 27.31,24.26 29.84,24.26 | 29.84,24.26 31.12,24.26 IC1.16
VCCO
  Top 0.762: X1.10 109.86,28.07 106.68,31.24 106.68,43.94 109.86,47.12 X1.3 109.86,47.75 107.31,50.29 107.31,73.15 | 107.31,73.15 112.4,78.23 112.4,85.22 C1.+ | 107.31,73.15 103.51,69.34 103.51,56.64 93.34,56.64 IC10.3